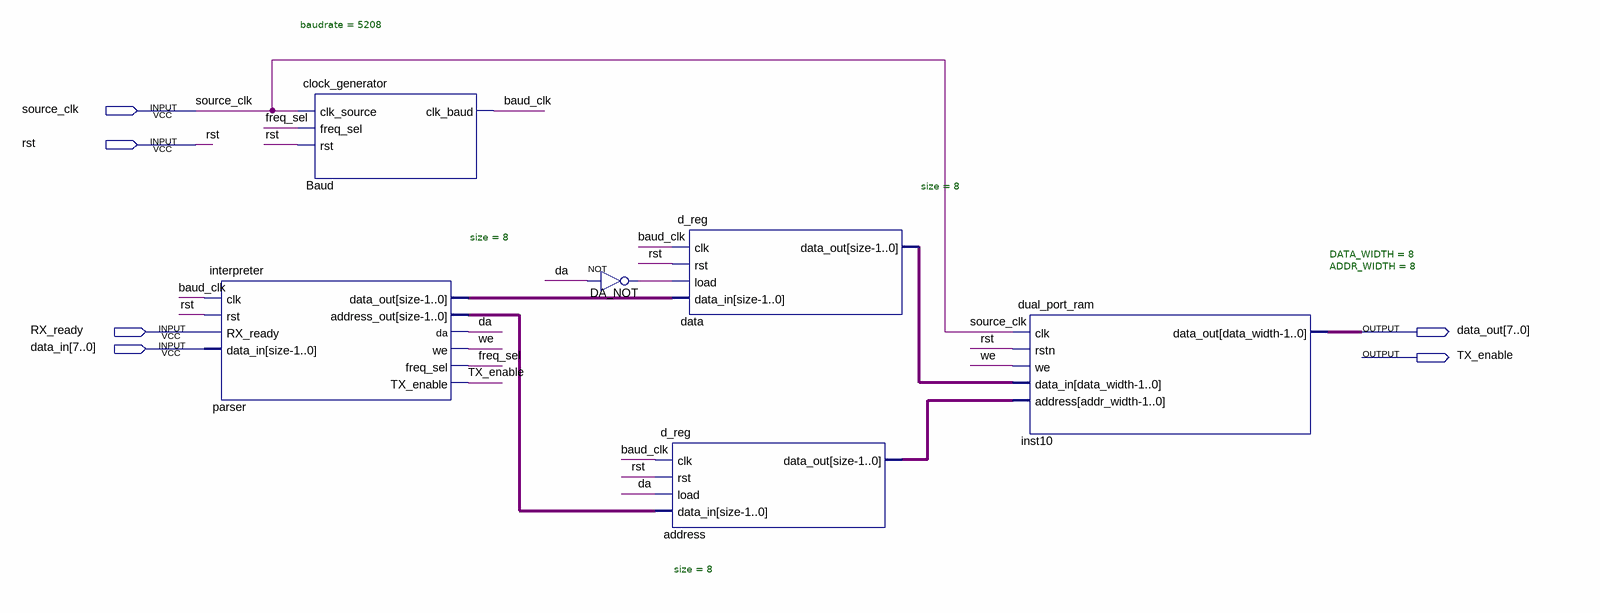
[diagram p0: schematic sheet]
// Quartus schematic mem_component.bdf as structural Verilog: 6 symbols, 6 pins
module mem_component (
  input  source_clk,
  input  rst,
  input  RX_ready,
  input  [7:0] data_in,
  output [7:0] data_out,
  output TX_enable
);

  wire baud_clk, da, DA_NOT_out, freq_sel, we;
  wire [7:0] address_data_out, data_data_out, parser_address_out, parser_data_out;

  interpreter #(.size(8)) parser (
    .clk(baud_clk), .rst(rst), .RX_ready(RX_ready), .data_in(data_in), .data_out(parser_data_out),
    .address_out(parser_address_out), .da(da), .we(we), .freq_sel(freq_sel), .TX_enable(TX_enable));
  clock_generator #(.baudrate(5208)) Baud (
    .clk_source(source_clk), .freq_sel(freq_sel), .rst(rst), .clk_baud(baud_clk));
  not DA_NOT (DA_NOT_out, da);
  d_reg #(.size(8)) data (
    .clk(baud_clk), .rst(rst), .load(DA_NOT_out), .data_in(parser_data_out), .data_out(data_data_out));
  d_reg #(.size(8)) address (
    .clk(baud_clk), .rst(rst), .load(da), .data_in(parser_address_out), .data_out(address_data_out));
  dual_port_ram #(.DATA_WIDTH(8), .ADDR_WIDTH(8)) inst10 (
    .clk(source_clk), .rstn(rst), .we(we), .data_in(data_data_out), .address(address_data_out),
    .data_out(data_out));
endmodule
